# EAGLE schematic Retro|Watch (EAGLE 7.3.0)
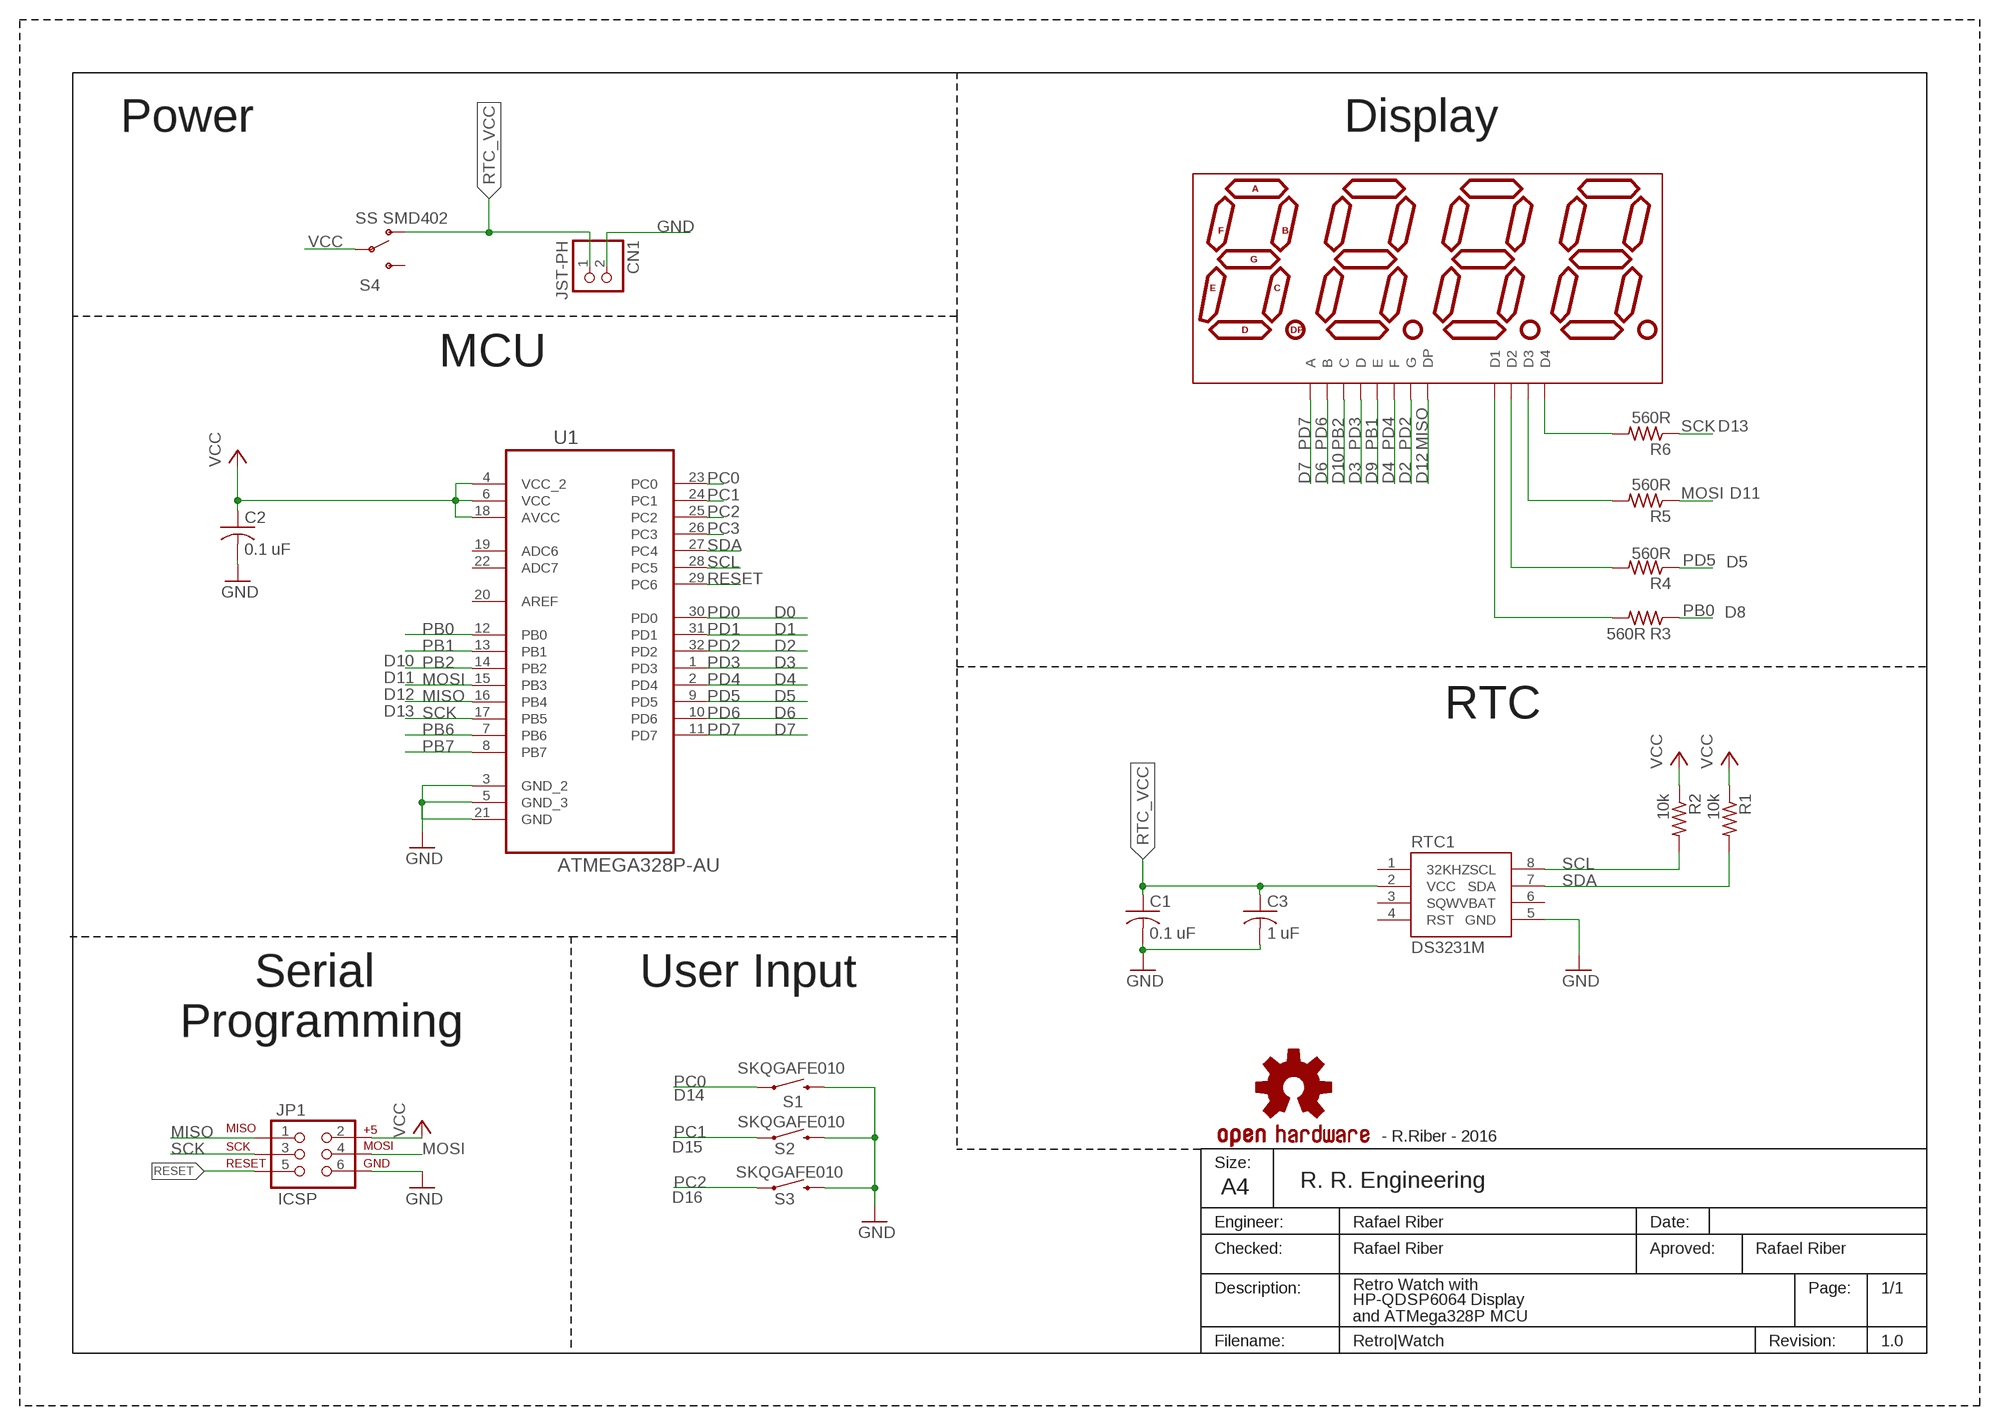
[diagram p0: schematic, sheet 1]

## Parts
C1  0.1 uF  C-USC0805  [C0805]
C2  0.1 uF  C-USC0805  [C0805]
C3  1 uF  C-USC0805  [C0805]
CN1  JST-PH  JST_2PIN-SMT-RA  [JST-PH-2-SMT-RA]
DISP1  hp  7-SEGMENT-4DIGIT-COUNTER-HP-BUBBLE  [DIL12]
JP1  ICSP  AVR_SPI_PRG_62X3_LOCK  [2X3_LOCK]
LOGO1  OSHW-LOGOM-COPPER  [OSHW-LOGO-M_COPPER]
R1  10k  R-US_R0805  [R0805]
R2  10k  R-US_R0805  [R0805]
R3  560R  R-US_R0805  [R0805]
R4  560R  R-US_R0805  [R0805]
R5  560R  R-US_R0805  [R0805]
R6  560R  R-US_R0805  [R0805]
RTC1  DS3231M  [SOIC8]
S1  SKQGAFE010  SWITCH-MOMENTARY-2SMD  [TACTILE-SWITCH-SMD]
S2  SKQGAFE010  SWITCH-MOMENTARY-2SMD  [TACTILE-SWITCH-SMD]
S3  SKQGAFE010  SWITCH-MOMENTARY-2SMD  [TACTILE-SWITCH-SMD]
S4  SS SMD402  SWITCH-SPDTSMD2  [SWITCH-SPDT-SMD]
U1  ATMEGA328P-AU  [QFP80P900X900X120-32N]

## Nets
GND: C1.2 C2.2 C3.2 CN1.2 JP1.6 RTC1.5(GND) S1.3 S2.3 S3.3 U1.3(GND_2) U1.5(GND_3) U1.21(GND)
MISO: DISP1.5(DP) JP1.1 U1.16(PB4)
MOSI: JP1.4 R5.1 U1.15(PB3)
N$1: DISP1.1(D1) R3.2
N$2: DISP1.10(D2) R4.2
N$3: DISP1.4(D3) R5.2
N$4: DISP1.6(D4) R6.2
PB0: R3.1 U1.12(PB0)
PB1: DISP1.2(E) U1.13(PB1)
PB2: DISP1.3(C) U1.14(PB2)
PB6: U1.7(PB6)
PB7: U1.8(PB7)
PC0: S1.1 U1.23(PC0)
PC1: S2.1 U1.24(PC1)
PC2: S3.1 U1.25(PC2)
PC3: U1.26(PC3)
PD0: U1.30(PD0)
PD1: U1.31(PD1)
PD2: DISP1.7(G) U1.32(PD2)
PD3: DISP1.8(D) U1.1(PD3)
PD4: DISP1.9(F) U1.2(PD4)
PD5: R4.1 U1.9(PD5)
PD6: DISP1.11(B) U1.10(PD6)
PD7: DISP1.12(A) U1.11(PD7)
RESET: JP1.5 U1.29(PC6)
RTC_VCC: C1.1 C3.1 CN1.1 RTC1.2(VCC) S4.1(O)
SCK: JP1.3 R6.1 U1.17(PB5)
SCL: R2.2 RTC1.8(SCL) U1.28(PC5)
SDA: R1.2 RTC1.7(SDA) U1.27(PC4)
VCC: C2.1 JP1.2 R1.1 R2.1 S4.2(P) U1.4(VCC_2) U1.6(VCC) U1.18(AVCC)
Unconnected: RTC1.1(32KHZ) RTC1.3(SQW) RTC1.4(RST) S4.3(S) U1.19(ADC6) U1.20(AREF) U1.22(ADC7)

## Notes on the sheet
- Power | Display
- MCU
- D13
- D7 | D6 | D10 | D3 | D9 | D4 | D2 | D12
- D11
- D5
- D0 | D8
- D1
- D2
- D10 | D3
- D11 | D4
- D12 | D5
- D13 | D6 | RTC
- D7
- User Input
- Serial 
  Programming
- D14
- - R.Riber - 2016
- D15
- Size:
- A4 | R. R. Engineering
- D16
- Engineer: | Rafael Riber | Date:
- Checked: | Rafael Riber | Aproved: | Rafael Riber
- Description: | Retro Watch with | Page:
- HP-QDSP6064 Display
- and ATMega328P MCU
- Filename: | Revision: | 1.0

## Power pins joined to a net without a drawn wire
VBAT: RTC1.6(VBAT)

## Library data of the parts
C1 C2 = adafruit:C-US: CAPACITOR, American symbol; MF: WALSIN; MPN: 0805B104K500CT; OC_FARNELL: 2496944
C3 = adafruit:C-US: CAPACITOR, American symbol; OC_FARNELL: unknown
CN1 = adafruit:JST_2PIN: JST 2-Pin Connectors of various flavors SMT-RA (S2B-PH-SM4) 4UConnector #17311 SMT (B2B-PH-SM4) THM-RA (S2B-PH) THM (B2B-PH); OC_FARNELL: unknown
DISP1 = SparkFun-Displays:7-SEGMENT-4DIGIT-COUNTER; OC_FARNELL: unknown; STOREFRONT: COM-12710
JP1 = SparkFun-Connectors:AVR_SPI_PRG_6: AVR ISP 6 Pin This is the reduced ISP connector for AVR programming. Common on Arduino. This footprint will take up less PCB space and can be used with a 10-pin to 6-pin adapter such as SKU: BOB-08508 **Special note about "TEST_POINT" package. The stop mask is on the top side, so if you want your programming test points to be on the bottom of your board, make sure to place this package on the bottom side of the board. This also ensure that the orientation to program from the bottom side will be correct.; OC_FARNELL: unknown
LOGO1 = SparkFun-Aesthetics:OSHW-LOGO: Open Source Hardware Logo This logo indicates the piece of hardware it is found on incorporates a OSHW license and/or adheres to the definition of open source hardware found here: http://freedomdefined.org/OSHW; OC_FARNELL: unknown
R1-R6 = adafruit:R-US_: RESISTOR, American symbol; OC_FARNELL: unknown
RTC1 = SparkFun-DigitalIC:DS3231M: DS3231M Real Time Clock. Accuracy +/-5ppm. Battery Backup. 2.3V to 5.5V.; OC_FARNELL: unknown; PROD_ID: IC-11985
S1-S3 = SparkFun-Electromechanical:SWITCH-MOMENTARY-2: Various NO switches- pushbuttons, reed, etc; OC_FARNELL: unknown; PROD_ID: SWCH-08247
S4 = SparkFun-Electromechanical:SWITCH-SPDT: SPDT Switch Simple slide switch, Spark Fun Electronics SKU : COM-00102 DPDT SMT slide switch, AYZ0202, SWCH-08179; OC_FARNELL: unknown
U1 = Atmel_By_element14_Batch_1-00:ATMEGA328P-AU: 8-bit Microcontroller with In-System Programmable Flash; MF: ATMEL; MPN: ATMEGA328P-AU; OC_FARNELL: 1715486; OC_NEWARK: 14R4631; PACKAGE: TQFP-32; SUPPLIER: Atmel